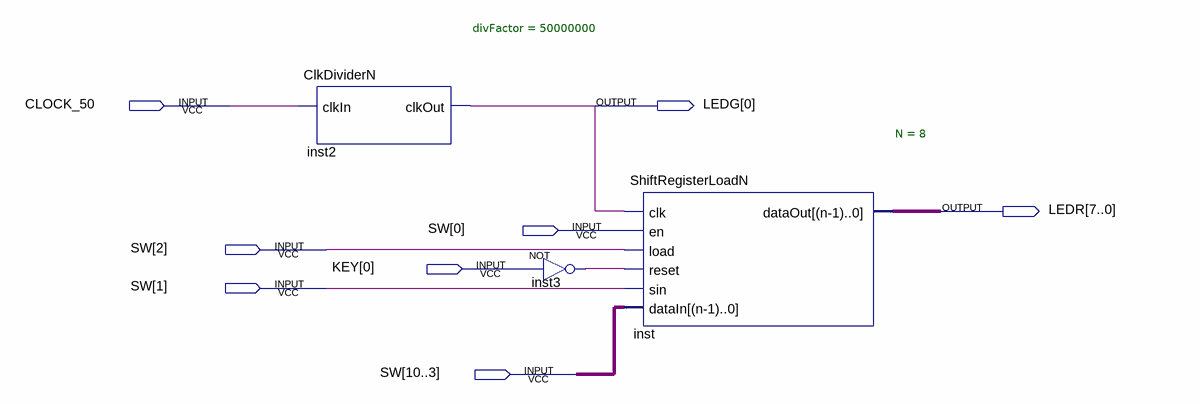
[diagram p0: schematic sheet]
// Quartus schematic ShiftRegisterDemo.bdf as structural Verilog: 3 symbols, 8 pins
module ShiftRegisterDemo (
  input  CLOCK_50,
  input  [10:0] SW,
  input  [0:0] KEY,
  output [0:0] LEDG,
  output [7:0] LEDR
);

  wire inst3_out;

  ClkDividerN #(.divFactor(50000000)) inst2 (.clkIn(CLOCK_50), .clkOut(LEDG[0]));
  not inst3 (inst3_out, KEY[0]);
  ShiftRegisterLoadN #(.N(8)) inst (
    .clk(LEDG[0]), .en(SW[0]), .load(SW[2]), .reset(inst3_out), .sin(SW[1]), .dataIn(SW[10:3]), .dataOut(LEDR));
endmodule
